# EAGLE schematic SPI LCD Backpack (EAGLE 7.1.0)
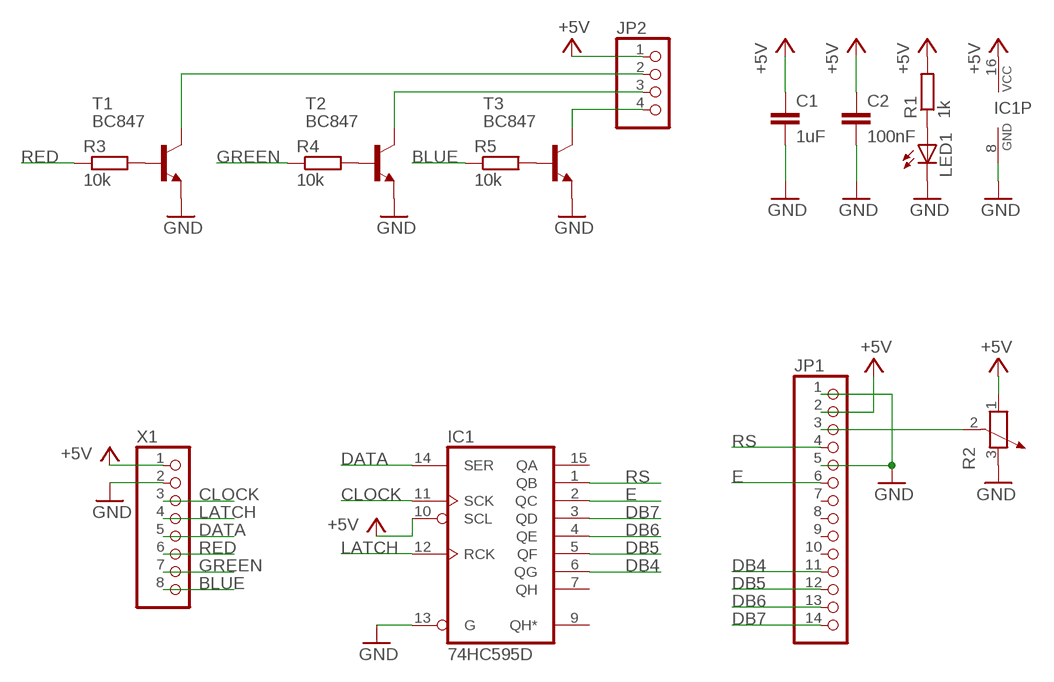
[diagram p0: schematic, sheet 1]

## Parts
C1  1uF  C-EUC0805K  [C0805K]
C2  100nF  C-EUC0805K  [C0805K]
IC1  74HC595D  [SO16]
JP1  PINHD-1X14  [1X14]
JP2  PINHD-1X4  [1X04]
LED1  LED3MM  [LED3MM]
R1  1k  R-EU_0805  [R0805]
R2  POTENTIOMETER_3386F  [3386F]
R3  10k  R-EU_0805  [R0805]
R4  10k  R-EU_0805  [R0805]
R5  10k  R-EU_0805  [R0805]
T1  BC847  [SOT23]
T2  BC847  [SOT23]
T3  BC847  [SOT23]
X1  22-23-2081  [22-23-2081]

## Nets
+5V: C1.1 C2.1 IC1.10(SCL) IC1.16(VCC) JP1.2 JP2.1 R1.2 R2.1 X1.1
BLUE: R5.1 X1.8
CLOCK: IC1.11(SCK) X1.3
DATA: IC1.14(SER) X1.5
DB4: IC1.6(QG) JP1.11
DB5: IC1.5(QF) JP1.12
DB6: IC1.4(QE) JP1.13
DB7: IC1.3(QD) JP1.14
E: IC1.2(QC) JP1.6
GND: C1.2 C2.2 IC1.8(GND) IC1.13(G) JP1.1 JP1.5 LED1.K(C) R2.3 T1.2(E) T2.2(E) T3.2(E) X1.2
GREEN: R4.1 X1.7
LATCH: IC1.12(RCK) X1.4
N$1: R3.2 T1.1(B)
N$2: R4.2 T2.1(B)
N$3: R5.2 T3.1(B)
N$4: LED1.A R1.1
N$5: JP1.3 R2.2
N$6: JP2.2 T1.3(C)
N$7: JP2.3 T2.3(C)
N$8: JP2.4 T3.3(C)
RED: R3.1 X1.6
RS: IC1.1(QB) JP1.4
Unconnected: IC1.7(QH) IC1.9(QH*) IC1.15(QA) JP1.7 JP1.8 JP1.9 JP1.10

## Library data of the parts
C1 C2 = SPI LCD Backpack:C-EU: CAPACITOR, European symbol
IC1 = SPI LCD Backpack:74*595: 8-bit SHIFT REGISTER, output latch
JP1 = SPI LCD Backpack:PINHD-1X14: PIN HEADER
JP2 = SPI LCD Backpack:PINHD-1X4: PIN HEADER
LED1 = SPI LCD Backpack:LED
R1 R3-R5 = SPI LCD Backpack:R-EU_: RESISTOR, European symbol
R2 = SPI LCD Backpack:POTENTIOMETER_: Potentiometer
T1-T3 = SPI LCD Backpack:BC847: NPN TRANSISTOR
X1 = SPI LCD Backpack:22-23-2081: .100" (2.54mm) Center Header - 8 Pin; MF: MOLEX; MPN: 22-23-2081; OC_FARNELL: 1756826; OC_NEWARK: 01C7592